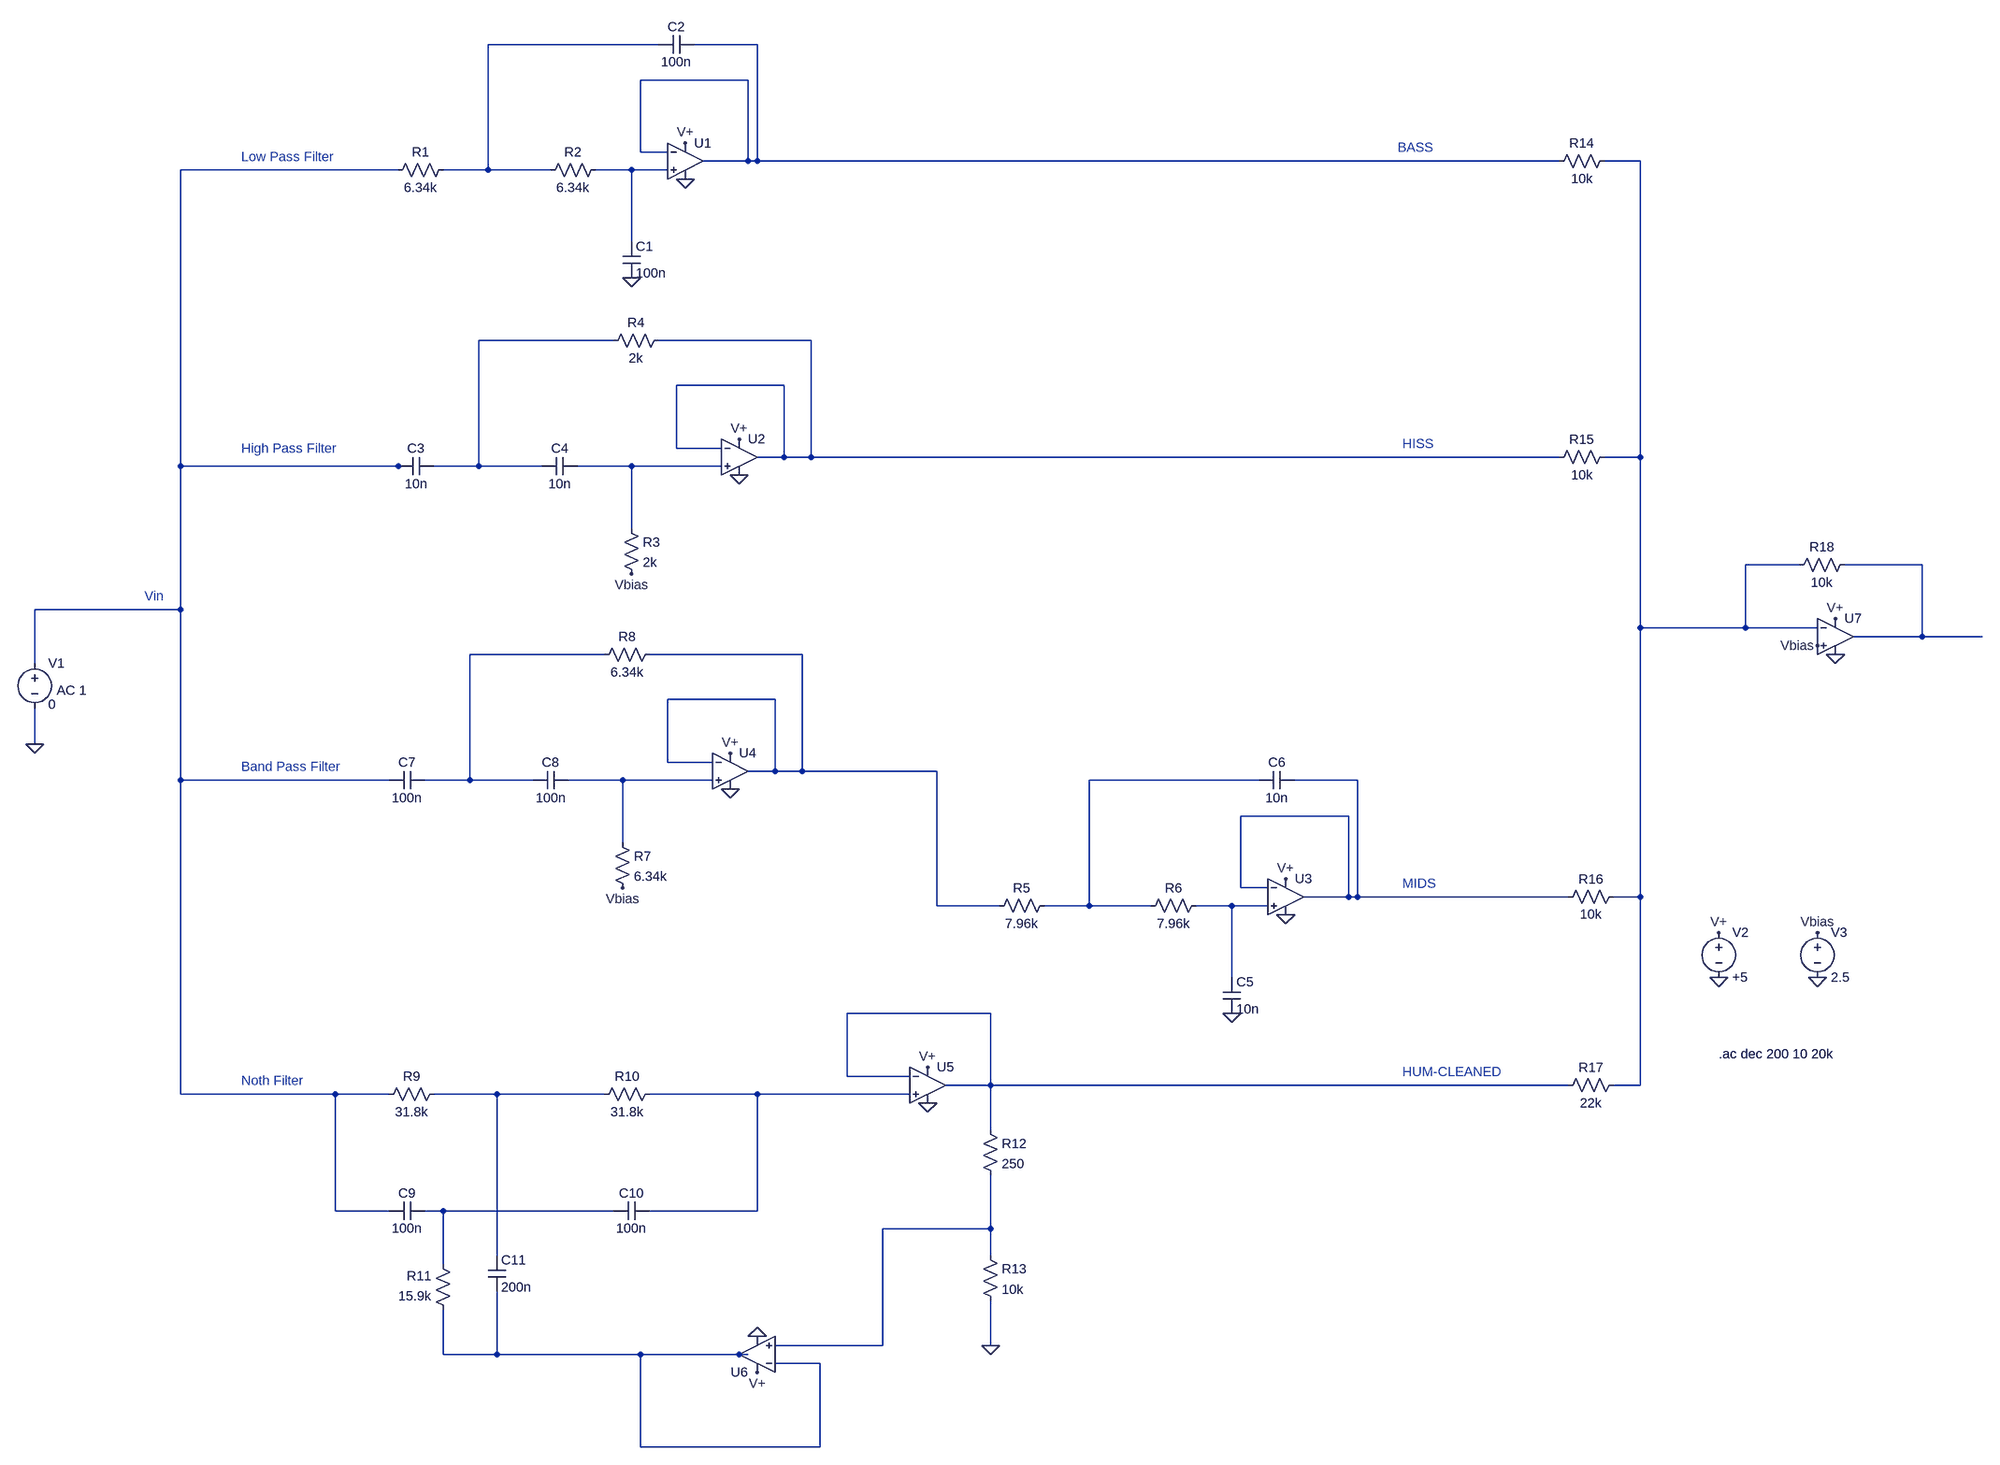
[diagram p0: schematic filter_bank.asc]
filter_bank.asc, the LTspice schematic file:
Version 4.1
SHEET 1 4468 2364
WIRE -1456 -2368 -1760 -2368
WIRE -1280 -2368 -1392 -2368
WIRE -1296 -2304 -1488 -2304
WIRE -1488 -2176 -1488 -2304
WIRE -1440 -2176 -1488 -2176
WIRE -1296 -2160 -1296 -2304
WIRE -1296 -2160 -1376 -2160
WIRE -1280 -2160 -1280 -2368
WIRE -1280 -2160 -1296 -2160
WIRE 192 -2160 -1280 -2160
WIRE 336 -2160 272 -2160
WIRE -1920 -2144 -2320 -2144
WIRE -1760 -2144 -1760 -2368
WIRE -1760 -2144 -1840 -2144
WIRE -1648 -2144 -1760 -2144
WIRE -1504 -2144 -1568 -2144
WIRE -1440 -2144 -1504 -2144
WIRE -1504 -2016 -1504 -2144
WIRE -1536 -1840 -1776 -1840
WIRE -1184 -1840 -1456 -1840
WIRE -1232 -1760 -1424 -1760
WIRE -1424 -1648 -1424 -1760
WIRE -1344 -1648 -1424 -1648
WIRE -1232 -1632 -1232 -1760
WIRE -1232 -1632 -1280 -1632
WIRE -1184 -1632 -1184 -1840
WIRE -1184 -1632 -1232 -1632
WIRE 192 -1632 -1184 -1632
WIRE 336 -1632 336 -2160
WIRE 336 -1632 272 -1632
WIRE -2320 -1616 -2320 -2144
WIRE -1920 -1616 -2320 -1616
WIRE -1904 -1616 -1920 -1616
WIRE -1776 -1616 -1776 -1840
WIRE -1776 -1616 -1856 -1616
WIRE -1664 -1616 -1776 -1616
WIRE -1504 -1616 -1600 -1616
WIRE -1344 -1616 -1504 -1616
WIRE -1504 -1504 -1504 -1616
WIRE 720 -1440 624 -1440
WIRE 944 -1440 800 -1440
WIRE -2320 -1360 -2320 -1616
WIRE -2320 -1360 -3008 -1360
WIRE 336 -1328 336 -1632
WIRE 624 -1328 624 -1440
WIRE 624 -1328 336 -1328
WIRE 752 -1328 624 -1328
WIRE 944 -1312 944 -1440
WIRE 944 -1312 816 -1312
WIRE 1376 -1312 944 -1312
WIRE -1552 -1280 -1792 -1280
WIRE -1200 -1280 -1472 -1280
WIRE -3008 -1264 -3008 -1360
WIRE -1248 -1200 -1440 -1200
WIRE -3008 -1120 -3008 -1184
WIRE -1440 -1088 -1440 -1200
WIRE -1360 -1088 -1440 -1088
WIRE -1248 -1072 -1248 -1200
WIRE -1248 -1072 -1296 -1072
WIRE -1200 -1072 -1200 -1280
WIRE -1200 -1072 -1248 -1072
WIRE -960 -1072 -1200 -1072
WIRE -2320 -1056 -2320 -1360
WIRE -1936 -1056 -2320 -1056
WIRE -1792 -1056 -1792 -1280
WIRE -1792 -1056 -1872 -1056
WIRE -1680 -1056 -1792 -1056
WIRE -1520 -1056 -1616 -1056
WIRE -1360 -1056 -1520 -1056
WIRE -384 -1056 -688 -1056
WIRE -208 -1056 -320 -1056
WIRE -224 -992 -416 -992
WIRE -1520 -944 -1520 -1056
WIRE -416 -864 -416 -992
WIRE -368 -864 -416 -864
WIRE -224 -848 -224 -992
WIRE -224 -848 -304 -848
WIRE -208 -848 -208 -1056
WIRE -208 -848 -224 -848
WIRE 208 -848 -208 -848
WIRE 336 -848 336 -1328
WIRE 336 -848 288 -848
WIRE -960 -832 -960 -1072
WIRE -848 -832 -960 -832
WIRE -688 -832 -688 -1056
WIRE -688 -832 -768 -832
WIRE -576 -832 -688 -832
WIRE -432 -832 -496 -832
WIRE -368 -832 -432 -832
WIRE -432 -704 -432 -832
WIRE -864 -640 -1120 -640
WIRE -1120 -528 -1120 -640
WIRE -1008 -528 -1120 -528
WIRE -864 -512 -864 -640
WIRE -864 -512 -944 -512
WIRE 208 -512 -864 -512
WIRE 336 -512 336 -848
WIRE 336 -512 288 -512
WIRE -2320 -496 -2320 -1056
WIRE -2032 -496 -2320 -496
WIRE -1936 -496 -2032 -496
WIRE -1744 -496 -1856 -496
WIRE -1552 -496 -1744 -496
WIRE -1280 -496 -1472 -496
WIRE -1008 -496 -1280 -496
WIRE -864 -432 -864 -512
WIRE -2032 -288 -2032 -496
WIRE -1936 -288 -2032 -288
WIRE -1840 -288 -1872 -288
WIRE -1536 -288 -1840 -288
WIRE -1280 -288 -1280 -496
WIRE -1280 -288 -1472 -288
WIRE -864 -256 -864 -352
WIRE -864 -256 -1056 -256
WIRE -1744 -208 -1744 -496
WIRE -864 -208 -864 -256
WIRE -1840 -192 -1840 -288
WIRE -1056 -48 -1056 -256
WIRE -1056 -48 -1248 -48
WIRE -864 -48 -864 -128
WIRE -1840 -32 -1840 -112
WIRE -1744 -32 -1744 -144
WIRE -1744 -32 -1840 -32
WIRE -1488 -32 -1744 -32
WIRE -1312 -32 -1488 -32
WIRE -1296 -32 -1312 -32
WIRE -1168 -16 -1248 -16
WIRE -1488 160 -1488 -32
WIRE -1168 160 -1168 -16
WIRE -1168 160 -1488 160
FLAG 576 -784 V+
FLAG 576 -704 0
FLAG -1504 -1952 0
FLAG 752 -704 0
FLAG -1408 -2128 0
FLAG -1408 -2192 V+
FLAG -1312 -1600 0
FLAG -1312 -1664 V+
FLAG -432 -640 0
FLAG -336 -816 0
FLAG -336 -880 V+
FLAG -1328 -1040 0
FLAG -1328 -1104 V+
FLAG -976 -480 0
FLAG -1280 -64 0
FLAG -976 -544 V+
FLAG -1280 0 V+
FLAG -864 -48 0
FLAG 784 -1280 0
FLAG 784 -1344 V+
FLAG 752 -784 Vbias
FLAG -1504 -1424 Vbias
FLAG -1520 -864 Vbias
FLAG 752 -1296 Vbias
FLAG -3008 -1120 0
SYMBOL voltage -3008 -1280 R0
WINDOW 3 24 89 Left 2
WINDOW 123 39 64 Left 2
WINDOW 39 0 0 Left 0
SYMATTR Value 0
SYMATTR Value2 AC 1
SYMATTR InstName V1
SYMBOL voltage 576 -800 R0
WINDOW 123 0 0 Left 0
WINDOW 39 0 0 Left 0
SYMATTR InstName V2
SYMATTR Value +5
SYMBOL res -1824 -2160 R90
WINDOW 0 0 56 VBottom 2
WINDOW 3 32 56 VTop 2
SYMATTR InstName R1
SYMATTR Value 6.34k
SYMBOL cap -1520 -2016 R0
SYMATTR InstName C1
SYMATTR Value 100n
SYMBOL res -1552 -2160 R90
WINDOW 0 0 56 VBottom 2
WINDOW 3 32 56 VTop 2
SYMATTR InstName R2
SYMATTR Value 6.34k
SYMBOL OpAmps\\UniversalOpAmp2 -1408 -2160 R0
SYMATTR InstName U1
SYMBOL cap -1392 -2384 R90
WINDOW 0 0 32 VBottom 2
WINDOW 3 32 32 VTop 2
SYMATTR InstName C2
SYMATTR Value 100n
SYMBOL voltage 752 -800 R0
WINDOW 123 0 0 Left 0
WINDOW 39 0 0 Left 0
SYMATTR InstName V3
SYMATTR Value 2.5
SYMBOL cap -1856 -1632 R90
WINDOW 0 0 32 VBottom 2
WINDOW 3 32 32 VTop 2
SYMATTR InstName C3
SYMATTR Value 10n
SYMBOL cap -1600 -1632 R90
WINDOW 0 0 32 VBottom 2
WINDOW 3 32 32 VTop 2
SYMATTR InstName C4
SYMATTR Value 10n
SYMBOL OpAmps\\UniversalOpAmp2 -1312 -1632 R0
SYMATTR InstName U2
SYMBOL res -1520 -1520 R0
SYMATTR InstName R3
SYMATTR Value 2k
SYMBOL res -1440 -1856 R90
WINDOW 0 0 56 VBottom 2
WINDOW 3 32 56 VTop 2
SYMATTR InstName R4
SYMATTR Value 2k
SYMBOL res -752 -848 R90
WINDOW 0 0 56 VBottom 2
WINDOW 3 32 56 VTop 2
SYMATTR InstName R5
SYMATTR Value 7.96k
SYMBOL cap -448 -704 R0
SYMATTR InstName C5
SYMATTR Value 10n
SYMBOL res -480 -848 R90
WINDOW 0 0 56 VBottom 2
WINDOW 3 32 56 VTop 2
SYMATTR InstName R6
SYMATTR Value 7.96k
SYMBOL OpAmps\\UniversalOpAmp2 -336 -848 R0
SYMATTR InstName U3
SYMBOL cap -320 -1072 R90
WINDOW 0 0 32 VBottom 2
WINDOW 3 32 32 VTop 2
SYMATTR InstName C6
SYMATTR Value 10n
SYMBOL cap -1872 -1072 R90
WINDOW 0 0 32 VBottom 2
WINDOW 3 32 32 VTop 2
SYMATTR InstName C7
SYMATTR Value 100n
SYMBOL cap -1616 -1072 R90
WINDOW 0 0 32 VBottom 2
WINDOW 3 32 32 VTop 2
SYMATTR InstName C8
SYMATTR Value 100n
SYMBOL OpAmps\\UniversalOpAmp2 -1328 -1072 R0
SYMATTR InstName U4
SYMBOL res -1536 -960 R0
SYMATTR InstName R7
SYMATTR Value 6.34k
SYMBOL res -1456 -1296 R90
WINDOW 0 0 56 VBottom 2
WINDOW 3 32 56 VTop 2
SYMATTR InstName R8
SYMATTR Value 6.34k
SYMBOL res -1840 -512 R90
WINDOW 0 0 56 VBottom 2
WINDOW 3 32 56 VTop 2
SYMATTR InstName R9
SYMATTR Value 31.8k
SYMBOL res -1456 -512 R90
WINDOW 0 0 56 VBottom 2
WINDOW 3 32 56 VTop 2
SYMATTR InstName R10
SYMATTR Value 31.8k
SYMBOL cap -1872 -304 R90
WINDOW 0 0 32 VBottom 2
WINDOW 3 32 32 VTop 2
SYMATTR InstName C9
SYMATTR Value 100n
SYMBOL cap -1472 -304 R90
WINDOW 0 0 32 VBottom 2
WINDOW 3 32 32 VTop 2
SYMATTR InstName C10
SYMATTR Value 100n
SYMBOL cap -1760 -208 R0
SYMATTR InstName C11
SYMATTR Value 200n
SYMBOL res -1824 -96 R180
WINDOW 0 36 76 Left 2
WINDOW 3 36 40 Left 2
SYMATTR InstName R11
SYMATTR Value 15.9k
SYMBOL OpAmps\\UniversalOpAmp2 -976 -512 R0
SYMATTR InstName U5
SYMBOL OpAmps\\UniversalOpAmp2 -1280 -32 R180
SYMATTR InstName U6
SYMBOL res -880 -448 R0
SYMATTR InstName R12
SYMATTR Value 250
SYMBOL res -880 -224 R0
SYMATTR InstName R13
SYMATTR Value 10k
SYMBOL OpAmps\\UniversalOpAmp2 784 -1312 R0
SYMATTR InstName U7
SYMBOL res 288 -2176 R90
WINDOW 0 0 56 VBottom 2
WINDOW 3 32 56 VTop 2
SYMATTR InstName R14
SYMATTR Value 10k
SYMBOL res 288 -1648 R90
WINDOW 0 0 56 VBottom 2
WINDOW 3 32 56 VTop 2
SYMATTR InstName R15
SYMATTR Value 10k
SYMBOL res 304 -864 R90
WINDOW 0 0 56 VBottom 2
WINDOW 3 32 56 VTop 2
SYMATTR InstName R16
SYMATTR Value 10k
SYMBOL res 304 -528 R90
WINDOW 0 0 56 VBottom 2
WINDOW 3 32 56 VTop 2
SYMATTR InstName R17
SYMATTR Value 22k
SYMBOL res 816 -1456 R90
WINDOW 0 0 56 VBottom 2
WINDOW 3 32 56 VTop 2
SYMATTR InstName R18
SYMATTR Value 10k
TEXT 576 -568 Left 2 !.ac dec 200 10 20k
TEXT -2384 -1384 Left 2 ;Vin
TEXT -136 -2184 Left 2 ;BASS
TEXT -128 -1656 Left 2 ;HISS
TEXT -128 -872 Left 2 ;MIDS
TEXT -128 -536 Left 2 ;HUM-CLEANED
TEXT -2200 -2168 Left 2 ;Low Pass Filter
TEXT -2200 -1648 Left 2 ;High Pass Filter
TEXT -2200 -1080 Left 2 ;Band Pass Filter
TEXT -2200 -520 Left 2 ;Noth Filter

The netlist it stands for:
* filter_bank.asc
V1 N004 0 0 AC 1
V2 V+ 0 +5
R1 N001 N004 6.34k
C1 N005 0 100n
R2 N005 N001 6.34k
X§U1 N005 N002 V+ 0 N002 level2 Avol=1Meg GBW=10Meg Slew=10Meg Ilimit=25m Rail=0 Vos=0 En=0 Enk=0 In=0 Ink=0 Rin=500Meg  ; pins In+ In- V+ V- OUT
C2 N002 N001 100n
V3 Vbias 0 2.5
C3 N006 N004 10n
C4 N008 N006 10n
X§U2 N008 N007 V+ 0 N007 level2 Avol=1Meg GBW=10Meg Slew=10Meg Ilimit=25m Rail=0 Vos=0 En=0 Enk=0 In=0 Ink=0 Rin=500Meg  ; pins In+ In- V+ V- OUT
R3 N008 Vbias 2k
R4 N007 N006 2k
R5 N013 N011 7.96k
C5 N015 0 10n
R6 N015 N013 7.96k
X§U3 N015 N014 V+ 0 N014 level2 Avol=1Meg GBW=10Meg Slew=10Meg Ilimit=25m Rail=0 Vos=0 En=0 Enk=0 In=0 Ink=0 Rin=500Meg  ; pins In+ In- V+ V- OUT
C6 N014 N013 10n
C7 N010 N004 100n
C8 N012 N010 100n
X§U4 N012 N011 V+ 0 N011 level2 Avol=1Meg GBW=10Meg Slew=10Meg Ilimit=25m Rail=0 Vos=0 En=0 Enk=0 In=0 Ink=0 Rin=500Meg  ; pins In+ In- V+ V- OUT
R7 N012 Vbias 6.34k
R8 N011 N010 6.34k
R9 N017 N004 31.8k
R10 N018 N017 31.8k
C9 N019 N004 100n
C10 N018 N019 100n
C11 N017 N021 200n
R11 N021 N019 15.9k
X§U5 N018 N016 V+ 0 N016 level2 Avol=1Meg GBW=10Meg Slew=10Meg Ilimit=25m Rail=0 Vos=0 En=0 Enk=0 In=0 Ink=0 Rin=500Meg  ; pins In+ In- V+ V- OUT
X§U6 N020 N021 V+ 0 N021 level2 Avol=1Meg GBW=10Meg Slew=10Meg Ilimit=25m Rail=0 Vos=0 En=0 Enk=0 In=0 Ink=0 Rin=500Meg  ; pins In+ In- V+ V- OUT
R12 N016 N020 250
R13 N020 0 10k
X§U7 Vbias N003 V+ 0 N009 level2 Avol=1Meg GBW=10Meg Slew=10Meg Ilimit=25m Rail=0 Vos=0 En=0 Enk=0 In=0 Ink=0 Rin=500Meg  ; pins In+ In- V+ V- OUT
R14 N003 N002 10k
R15 N003 N007 10k
R16 N003 N014 10k
R17 N003 N016 22k
R18 N009 N003 10k
.ac dec 200 10 20k
* Vin
* BASS
* HISS
* MIDS
* HUM-CLEANED
* Low Pass Filter
* High Pass Filter
* Band Pass Filter
* Noth Filter
.lib UniversalOpAmp2.lib
.backanno
.end